# EAGLE design midiusb (EAGLE 5.11)
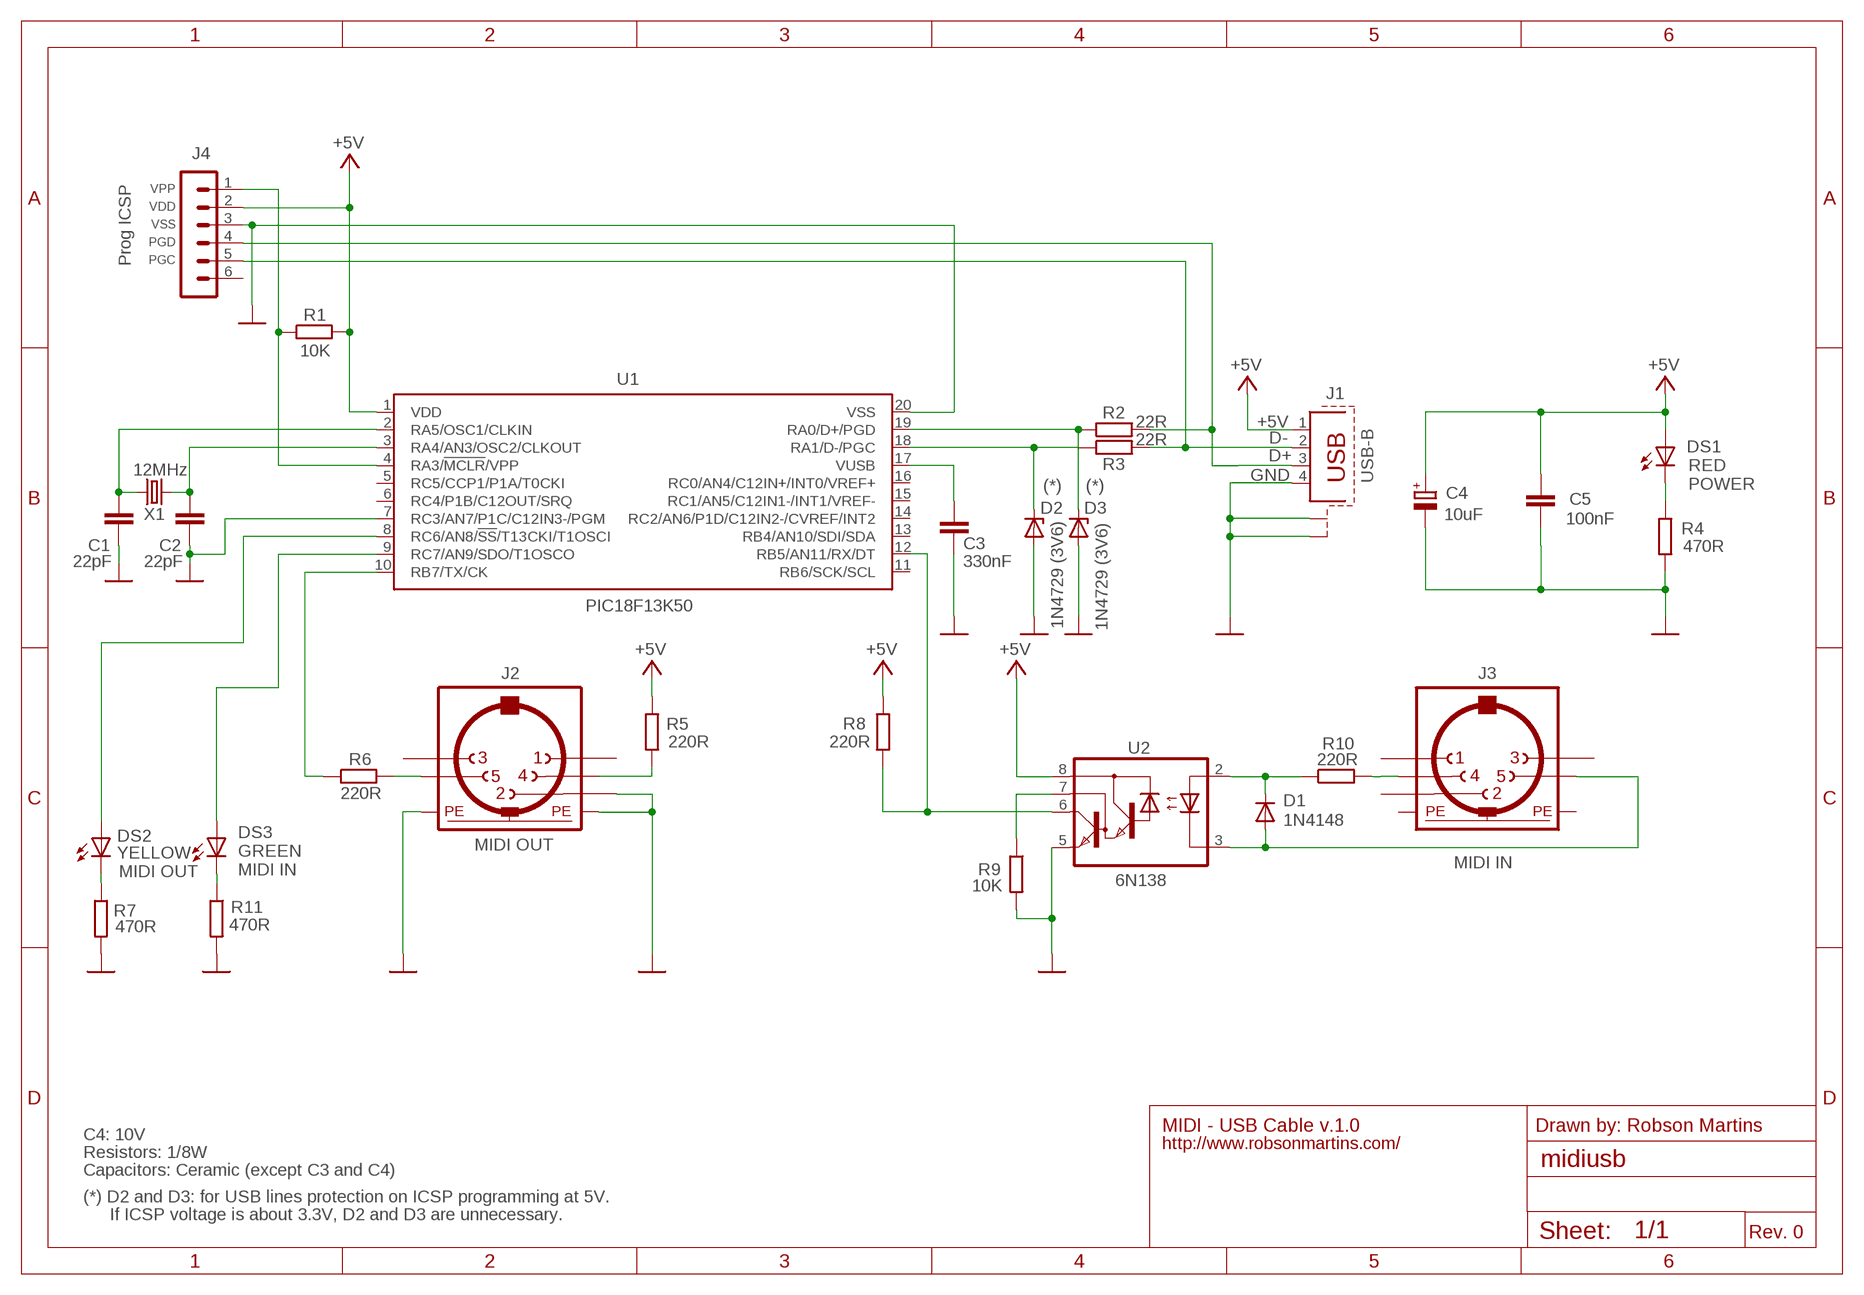
[diagram p0: schematic, sheet 1]

## Parts
C1  22pF  C-EU025-025X050  [C025-025X050]
C2  22pF  C-EU025-025X050  [C025-025X050]
C3  330nF  C-EU050-030X075  [C050-030X075]
C4  10uF  CPOL-EUE2,5-6E  [E2,5-6E]
C5  100nF  C-EU050-025X075  [C050-025X075]
D1  1N4148  1N4148DO35-7  [DO35-7]
D2  1N4729 (3V6)  ZENER-DIODEDO41Z10  [DO41Z10]
D3  1N4729 (3V6)  ZENER-DIODEDO41Z10  [DO41Z10]
DS1  RED  LED3MM  [LED3MM]
DS2  YELLOW  LED3MM  [LED3MM]
DS3  GREEN  LED3MM  [LED3MM]
J1  USB-B  PN61729-S  [PN61729-S]
J2  MAB5SH  [MAB5SH]
J3  MAB5SH  [MAB5SH]
J4  Prog ICSP  MA06-1  [MA06-1]
R1  10K  R-EU_0204/7  [0204/7]
R2  22R  R-EU_0204/7  [0204/7]
R3  22R  R-EU_0204/7  [0204/7]
R4  470R  R-EU_0204/7  [0204/7]
R5  220R  R-EU_0204/7  [0204/7]
R6  220R  R-EU_0204/7  [0204/7]
R7  470R  R-EU_0204/7  [0204/7]
R8  220R  R-EU_0204/7  [0204/7]
R9  10K  R-EU_0204/7  [0204/7]
R10  220R  R-EU_0204/7  [0204/7]
R11  470R  R-EU_0204/7  [0204/7]
U1  PIC18F13K50  PIC18F1XK50  [DIL20]
U2  6N138  [DIL08]
X1  12MHz  CRYSTALHC49U-V  [HC49U-V]

## Nets
+5V: C4.+ C5.1 DS1.A J1.1 J4.2 R1.2 R5.1 R8.1 U1.1(VDD) U2.8(VCC)
D+: J1.3 J4.4 R2.2
D-: J1.2 J4.5 R3.2
GND: C1.1 C2.1 C3.2 C4.- C5.2 D2.A D3.A J1.4 J1.S1 J1.S2 J2.2 J2.PE J2.PE@(PE) J4.3 R4.2 R7.2 R9.2 R11.2 U1.7(RC3/AN7/P1C/C12IN3-/PGM) U1.20(VSS) U2.5(GND)
LED_MIDI_IN: DS3.A U1.9(RC7/AN9/SDO/T1OSCO)
LED_MIDI_OUT: DS2.A U1.8(RC6/AN8/!SS!/T13CKI/T1OSCI)
N$13: D1.C R10.1 U2.2(A)
N$17: DS2.K(C) R7.1
N$20: R9.1 U2.7(VB)
N$21: DS3.K(C) R11.1
N$25: DS1.K(C) R4.1
OSC1: C1.2 U1.2(RA5/OSC1/CLKIN) X1.1
OSC2: C2.2 U1.3(RA4/AN3/OSC2/CLKOUT) X1.2
PGC_D-_CHIP: D2.C R3.1 U1.18(RA1/D-/PGC)
PGD_D+_CHIP: D3.C R2.1 U1.19(RA0/D+/PGD)
RX: R8.2 U1.12(RB5/AN11/RX/DT) U2.6(VO)
SINK_MIDI_IN: D1.A J3.5 U2.3(C)
SINK_MIDI_OUT: J2.5 R6.2
SRC_MIDI_IN: J3.4 R10.2
SRC_MIDI_OUT: J2.4 R5.2
TX: R6.1 U1.10(RB7/TX/CK)
VPP_ICSP: J4.1 R1.1 U1.4(RA3/!MCLR!/VPP)
VUSB: C3.1 U1.17(VUSB)
Unconnected: J2.1 J2.3 J3.1 J3.2 J3.3 J4.6 U1.5(RC5/CCP1/P1A/T0CKI) U1.6(RC4/P1B/C12OUT/SRQ) U1.11(RB6/SCK/SCL) U1.13(RB4/AN10/SDI/SDA) U1.14(RC2/AN6/P1D/C12IN2-/CVREF/INT2) U1.15(RC1/AN5/C12IN1-/INT1/VREF-) U1.16(RC0/AN4/C12IN+/INT0/VREF+)

## Notes on the sheet
- VPP
- VDD
- VSS
- PGD
- PGC
- (*) | (*) | POWER
- MIDI OUT
- MIDI IN
- MIDI OUT | MIDI IN
- MIDI - USB Cable v.1.0 | Drawn by: Robson Martins
- C4: 10V
- http://www.robsonmartins.com/
- Resistors: 1/8W
- Capacitors: Ceramic (except C3 and C4)
- (*) D2 and D3: for USB lines protection on ICSP programming at 5V.
- If ICSP voltage is about 3.3V, D2 and D3 are unnecessary.
- Rev. 0

## Power pins joined to a net without a drawn wire
PE: J3.PE J3.PE@(PE)

## Library data of the parts
C1-C3 C5 = rcl:C-EU: CAPACITOR, European symbol
C4 = rcl:CPOL-EU: POLARIZED CAPACITOR, European symbol
D1 = diode:1N4148: DIODE high speed (Philips)
D2 D3 = diode:ZENER-DIODE: Z-Diode
DS1-DS3 = led:LED: LED OSRAM: - CHIPLED LG R971, LG N971, LY N971, LG Q971, LY Q971, LO R971, LY R971 LH N974, LH R974 LS Q976, LO Q976, LY Q976 LO Q996 - Hyper CHIPLED LW Q18S LB Q993, LB Q99A, LB R99A - SideLED LS A670, LO A670, LY A670, LG A670, LP A670 LB A673, LV A673, LT A673, LW A673 LH A674 LY A675 LS A676, LA A676, LO A676, LY A676, LW A676 LS A679, LY A679, LG A679 - Hyper Micro SIDELED® LS Y876, LA Y876, LO Y876, LY Y876 LT Y87S - SmartLED LW L88C, LW L88S LB L89C, LB L89S, LG L890 LS L89K, LO L89K, LY L89K LS L896, LA L896, LO L896, LY L896 - TOPLED LS T670, LO T670, LY T670, LG T670, LP T670 LSG T670, LSP T670, LSY T670, LOP T670, LYG T670 LG T671, LOG T671, LSG T671 LB T673, LV T673, LT T673, LW T673 LH T674 LS T676, LA T676, LO T676, LY T676, LB T676, LH T676, LSB T676, LW T676 LB T67C, LV T67C, LT T67C, LS T67K, LO T67K, LY T67K, LW E67C LS E67B, LA E67B, LO E67B, LY E67B, LB E67C, LV E67C, LT E67C LW T67C LS T679, LY T679, LG T679 LS T770, LO T770, LY T770, LG T770, LP T770 LB T773, LV T773, LT T773, LW T773 LH T774 LS E675, LA E675, LY E675, LS T675 LS T776, LA T776, LO T776, LY T776, LB T776 LHGB T686 LT T68C, LB T68C - Hyper Mini TOPLED® LB M676 - Mini TOPLED Santana® LG M470 LS M47K, LO M47K, LY M47K Source: http://www.osram.convergy.de LUXEON: - LUMILED® LXK2-PW12-R00, LXK2-PW12-S00, LXK2-PW14-U00, LXK2-PW14-V00 LXK2-PM12-R00, LXK2-PM12-S00, LXK2-PM14-U00 LXK2-PE12-Q00, LXK2-PE12-R00, LXK2-PE12-S00, LXK2-PE14-T00, LXK2-PE14-U00 LXK2-PB12-K00, LXK2-PB12-L00, LXK2-PB12-M00, LXK2-PB14-N00, LXK2-PB14-P00, LXK2-PB14-Q00 LXK2-PR12-L00, LXK2-PR12-M00, LXK2-PR14-Q00, LXK2-PR14-R00 LXK2-PD12-Q00, LXK2-PD12-R00, LXK2-PD12-S00 LXK2-PH12-R00, LXK2-PH12-S00 LXK2-PL12-P00, LXK2-PL12-Q00, LXK2-PL12-R00 Source: www.luxeon.com KINGBRIGHT: KA-3528ASYC Source: www.kingbright.com
J1 = con-berg:PN61729-S: BERG USB connector; OC_FARNELL: unknown; OC_NEWARK: unknown
J2 J3 = con-hirschmann:MAB5SH: Female CONNECTOR 5 pins 90 deg. with shield, horizontal (DIN 41524); OC_FARNELL: 809883; OC_NEWARK: unknown
J4 = con-lstb:MA06-1: PIN HEADER; OC_FARNELL: unknown; OC_NEWARK: unknown
R1-R11 = resistor:R-EU_: RESISTOR, European symbol
U1 = microchip:PIC18F1XK50
U2 = optocoupler:6N138: MOTOROLA OPTO COUPLER; MF: VISHAY/TELEFUNKEN; MPN: 6N138; OC_FARNELL: 9860150; OC_NEWARK: 35K5294
X1 = crystal:CRYSTAL: CRYSTAL; OC_FARNELL: 1666969; OC_NEWARK: unknown

## Board
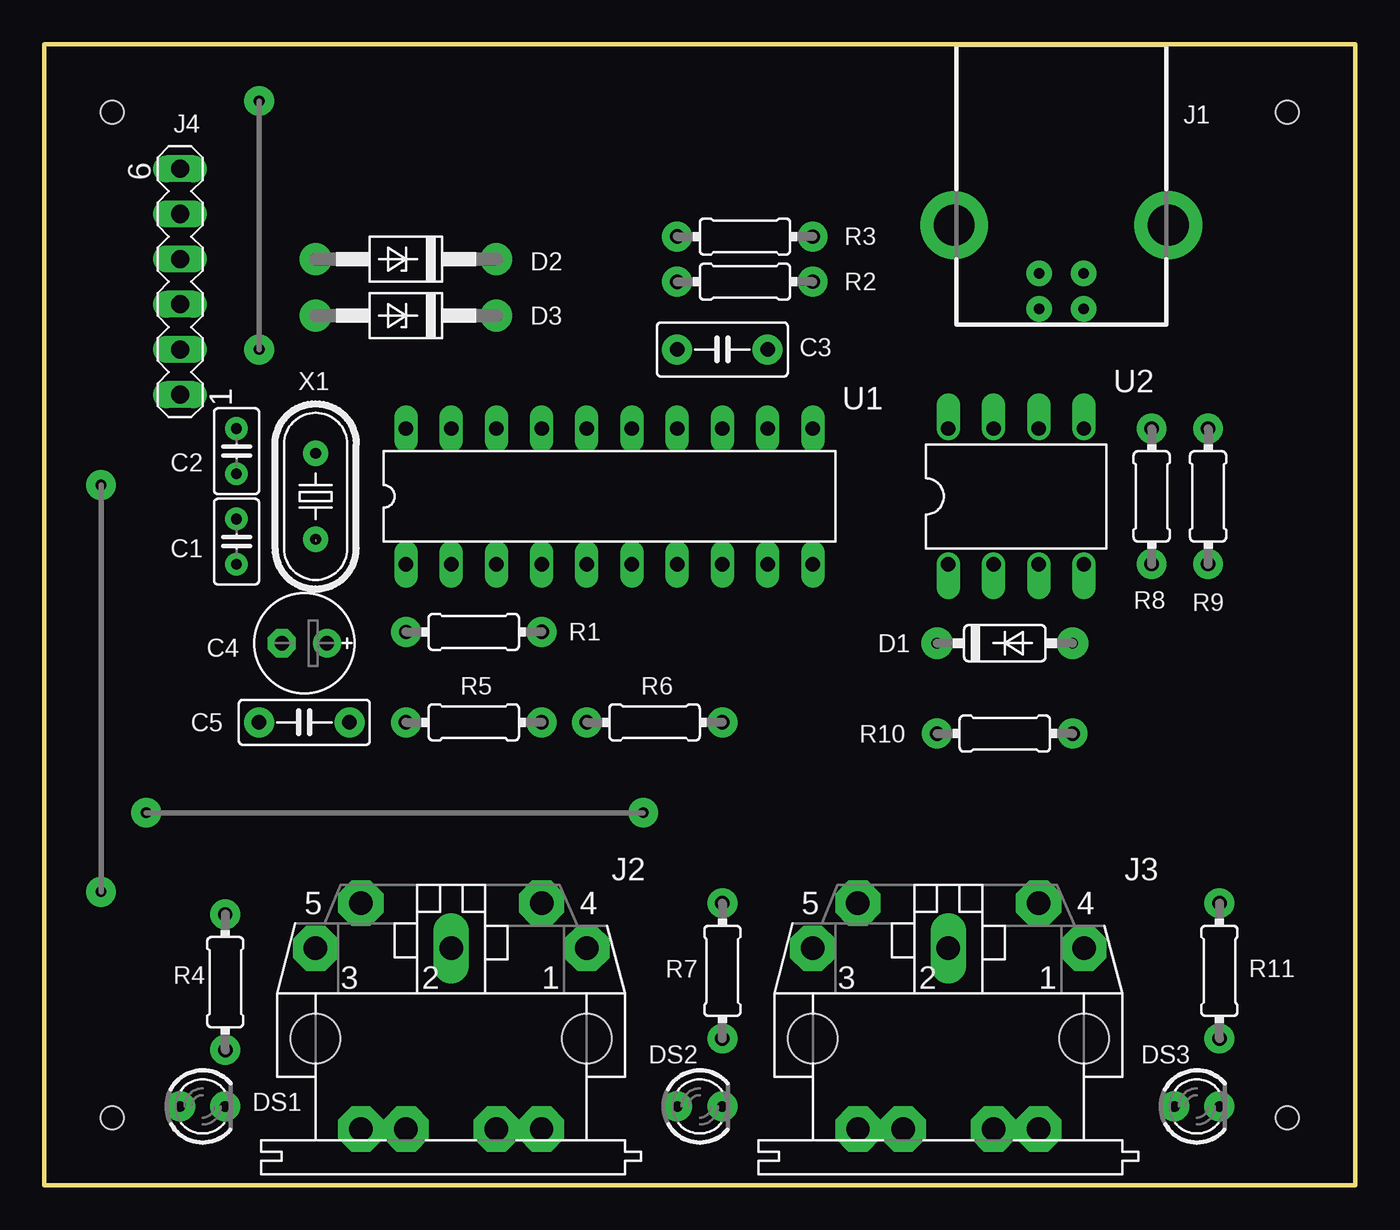
[diagram p1: board, top side]
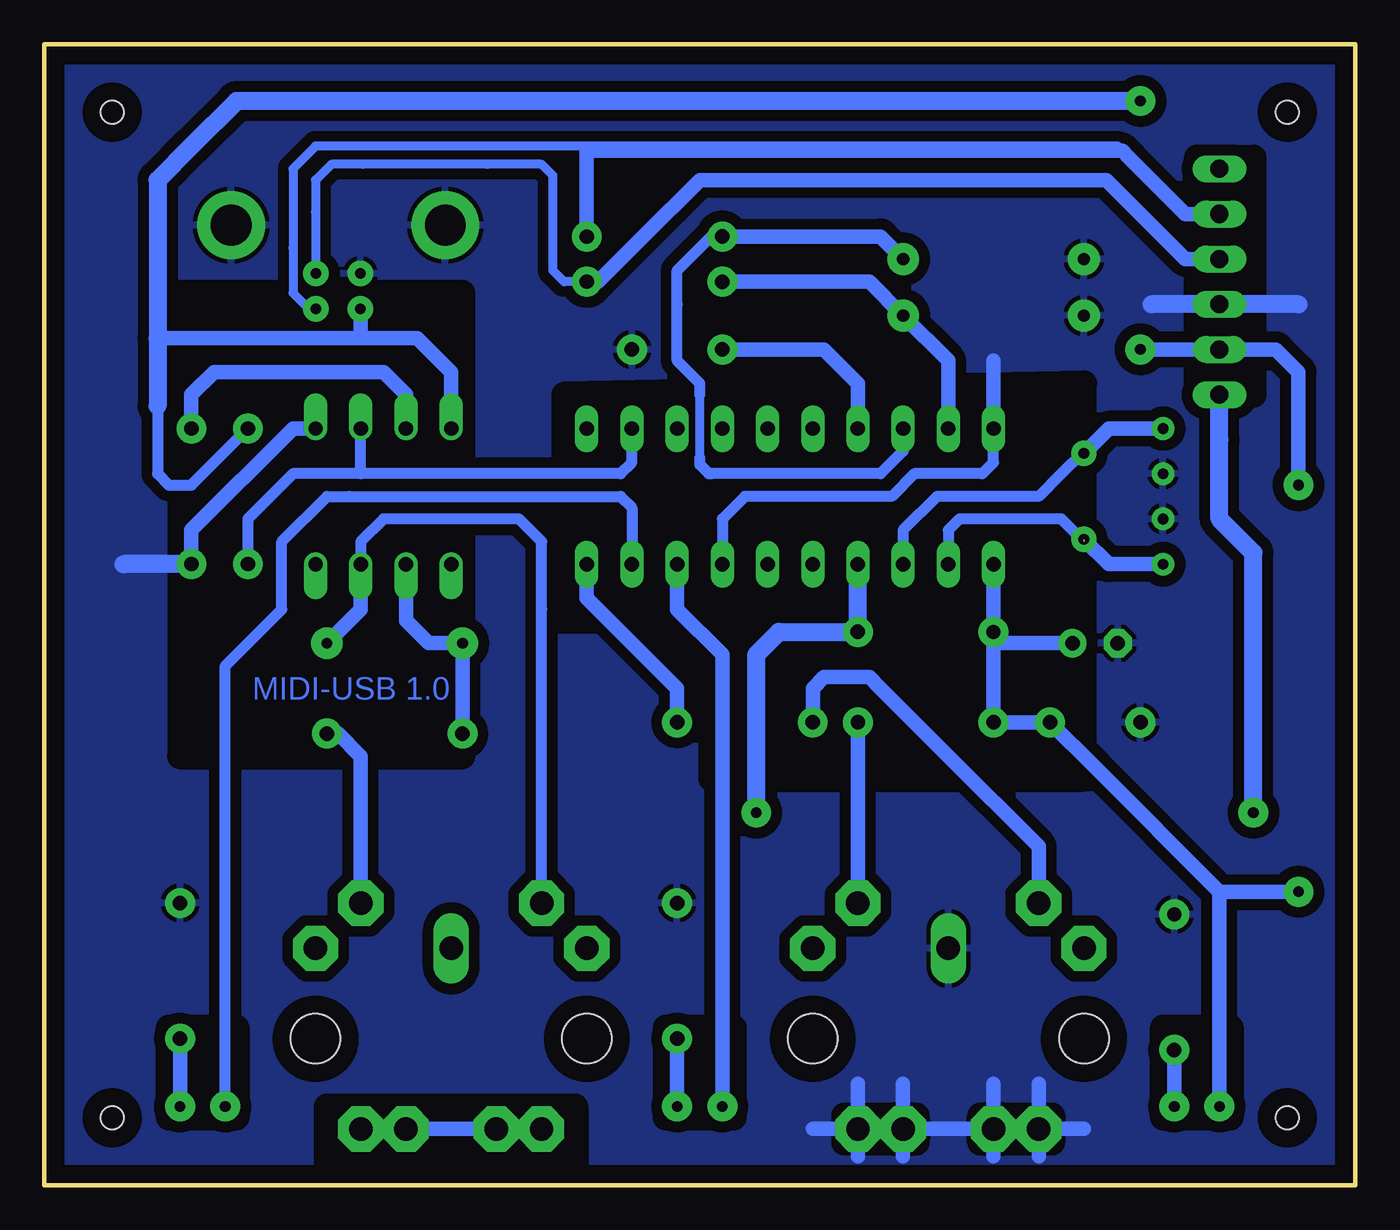
[diagram p2: board, bottom side, seen from below]

Size 73.66 x 64.14 mm. Coordinates in mm from the lower left corner, seen from the top.
Outline: 0,64.14 73.66,64.14 73.66,0 0,0 0,64.14
Copper layers (1*16): Top 0.035mm / dielectric 1.5mm / Bottom 0.035mm
Design rules "default": minimum track width 10mil, minimum drill 24mil, track to track 8mil, track to pad 8mil, pad to pad 8mil, via to via 8mil, smd to smd 8mil, copper to edge 40mil, drill to drill 8mil, minimum pad ring 10mil, minimum via ring 8mil, stop-mask expansion 4mil, vias tented up to drill 0mil, thermal gap 10mil
Holes 1.3 mm at 69.85,60.33 69.85,3.81 3.81,60.33 3.81,3.81
bRestrict: area 62.9,3.8 to 66.7,8.9; area 34.9,3.8 to 38.7,8.9; area 7,3.8 to 10.8,8.9; area 50.2,24.1 to 66,50.2; area 15.2,22.9 to 44.5,45.1; area 5.7,44.5 to 8.9,57.8; area 43.8,1.3 to 57.8,4.4; area 17,2.4 to 21.1,3.9; area 24.6,2.4 to 28.7,3.9

### Footprints (pad centres in the part's own frame; a part is rotated, then mirrored left to right if it is on the bottom)
C025-025X050 = drill 0.6 pad 1.27 round: 1 -1.27,0; 2 1.27,0
C050-030X075 = drill 0.813 pad 1.676 round: 1 -2.54,0; 2 2.54,0
E2,5-6E = drill 0.813 pad 1.575 round: + -1.27,0 | drill 0.813 pad 1.575 octagon: - 1.27,0
C050-025X075 = drill 0.813 pad 1.676 round: 1 -2.54,0; 2 2.54,0
DO35-7 = drill 0.6 pad 1.778 round: A 3.81,0; C -3.81,0
DO41Z10 = drill 0.7 pad 1.778 round: A 5.08,0; C -5.08,0
LED3MM = drill 0.6 pad 1.676 round: A -1.27,0; K 1.27,0
PN61729-S = drill 0.6 pad 1.422 round: 1 1.25,4.71; 2 -1.25,4.71; 3 -1.25,2.71; 4 1.25,2.71 | drill 2.3 pad 3.81 round: S1 -6.02,0; S2 6.02,0
MAB5SH = drill 1.321 pad 2.54 octagon: 1 7.62,5.08; 3 -7.62,5.08; 4 5.08,7.62; 5 -5.08,7.62; PE -2.54,-5.08; PE@ 2.54,-5.08 | drill 1.321 long: 2 0,5.08 | hole 2.794: 7.62,0; -7.62,0
MA06-1 = drill 1.016 long: 1 -6.35,0; 2 -3.81,0; 3 -1.27,0; 4 1.27,0; 5 3.81,0; 6 6.35,0
0204/7 = drill 0.813 pad 1.676 round: 1 -3.81,0 | drill 0.8 pad 1.676 round: 2 3.81,0
DIL20 = drill 0.813 long: 1 -11.43,-3.81; 2 -8.89,-3.81; 3 -6.35,-3.81; 4 -3.81,-3.81; 5 -1.27,-3.81; 6 1.27,-3.81; 7 3.81,-3.81; 8 6.35,-3.81; 9 8.89,-3.81; 10 11.43,-3.81; 11 11.43,3.81; 12 8.89,3.81; 13 6.35,3.81; 14 3.81,3.81; 15 1.27,3.81; 16 -1.27,3.81; 17 -3.81,3.81; 18 -6.35,3.81; 19 -8.89,3.81; 20 -11.43,3.81
DIL08 = drill 0.813 offset: 1 -3.81,-3.81; 2 -1.27,-3.81; 3 1.27,-3.81; 4 3.81,-3.81; 5 3.81,3.81; 6 1.27,3.81; 7 -1.27,3.81; 8 -3.81,3.81
HC49U-V = drill 0.6 pad 1.422 round: 1 -2.413,0; 2 2.413,0

### Placement (x,y rotation side)
C1  10.79,36.2 270 top
C2  10.79,41.27 90 top
C3  38.1,46.99 0 top
C4  14.61,30.48 180 top
C5  14.61,26.04 180 top
D1  53.98,30.48 0 top
D2  20.32,52.07 180 top
D3  20.32,48.9 180 top
DS1  8.89,4.45 0 top
DS2  36.83,4.45 0 top
DS3  64.77,4.45 0 top
J1  57.15,53.98 180 top
J2  22.86,8.26 0 top
J3  50.8,8.26 0 top
J4  7.62,50.8 90 top
R1  24.13,31.11 180 top
R2  39.37,50.8 0 top
R3  39.37,53.34 0 top
R4  10.16,11.43 90 top
R5  24.13,26.04 0 top
R6  34.29,26.04 180 top
R7  38.1,12.06 90 top
R8  62.23,38.73 270 top
R9  65.41,38.73 270 top
R10  53.98,25.4 0 top
R11  66.04,12.06 90 top
U1  31.75,38.73 0 top
U2  54.61,38.73 0 top
X1  15.24,38.73 90 top

### Tracks (layer width: path | path; a pad name or v marks a point on that pad's centre or on a via)
+5V  (via drill 0.6 pad 1.68)
  Top 0.254: v3.17,16.51 v3.17,39.37 | v12.06,46.99 v12.06,60.96
  Bottom 0.61: R8.1 65.41,39.37 66.67,39.37 67.31,40.01 67.31,43.81 67.31,47.62
  Bottom 0.813: 20.32,30.48 R5.1 C5.1 14.61,23.5 7.62,16.51 | 20.32,30.48 R1.2 U1.1 | 55.88,47.62 55.9,47.65 | U2.8 50.8,44.45 50.8,45.72 52.7,47.62 55.88,47.62 | 67.31,47.62 55.88,47.62 | 55.88,47.62 55.9,47.65 | 55.9,47.65 J1.1 | 55.88,47.62 55.9,47.65 | 20.32,30.48 C4.+ | DS1.A 7.62,16.51 | 7.62,16.51 v3.17,16.51 | v12.06,46.99 J4.2 4.45,46.99 3.17,45.72 v3.17,39.37
  Bottom 1.016: v12.06,60.96 62.87,60.96 65.41,58.42 67.31,56.52 67.31,47.62 67.31,43.81
D+
  Bottom 0.508: 58.42,51.28 58.42,54.74 58.42,56.52 57.53,57.4 55.75,57.4 48.77,57.4 45.72,57.4 45.09,56.77 45.09,51.44 44.45,50.8 R2.2
  Bottom 0.61: 58.42,51.28 J1.3
  Bottom 0.813: R2.2 42.55,50.8 40.01,53.34 36.83,56.52 13.97,56.52 9.53,52.07 J4.4
D-
  Bottom 0.406: 12.7,57.78 13.34,58.42
  Bottom 0.508: J1.2 58.79,49.27 59.69,50.16 59.69,52.7 59.69,57.15 58.42,58.42 48.26,58.42 13.34,58.42
  Bottom 0.813: R3.2 43.18,55.88 43.18,58.17 | 43.05,58.17 40.01,58.17 13.97,58.17 13.21,58.17 13.08,58.17 12.7,57.78 9.53,54.61 J4.5 | 43.05,58.17 43.18,58.17 | 43.05,58.17 43.18,58.17
GND  (via drill 1.3 pad 2.54)
  Bottom 0.406: 55.71,51.27 J1.4
  Bottom 0.61: U1.7 35.56,37.47 34.29,38.73 26.04,38.73 24.77,40.01 20.95,40.01 20.32,40.64 U1.20
  Bottom 0.813: U1.20 20.32,43.18 20.32,46.35 | U2.5 59.69,42.55 65.41,36.83 R9.2 | J2.PE@ v27.94,3.17 | J2.PE J2.PE@ | v17.78,3.17 J2.PE | v27.94,3.17 30.48,3.17 | v27.94,3.17 27.94,5.71 | J2.PE@ 25.4,5.71 | J2.PE 20.32,5.71 | v17.78,3.17 17.78,5.71 | v17.78,3.17 15.24,3.17 | 17.78,1.65 v17.78,3.17 | J2.PE 20.32,1.65 | J2.PE@ 25.4,1.65 | v27.94,3.17 27.94,1.65
  Bottom 1.016: R9.2 69.22,34.92 | 11.43,49.53 J4.3 3.17,49.53
  pour Bottom (isolate 0.61): 73.66,0 0,0 0,64.14 73.66,64.14
LED_MIDI_IN
  Bottom 0.61: U1.9 40.64,38.1 41.27,38.73 56.52,38.73 57.78,38.73 60.33,36.2 60.33,32.38 63.5,29.21 DS3.A
LED_MIDI_OUT
  Bottom 0.813: DS2.A 35.56,29.84 38.1,32.38 38.1,34.29 U1.8
N$13
  Bottom 0.813: R10.1 D1.C 52.07,30.48 53.34,31.75 U2.2
N$17
  Bottom 0.813: DS2.K 38.1,5.08 R7.1
N$20
  Bottom 0.813: U2.7 53.34,44.45 54.61,45.72 62.87,45.72 64.14,45.72 65.41,44.45 R9.1
N$21
  Bottom 0.813: DS3.K 66.04,5.08 R11.1
N$25
  Bottom 0.813: DS1.K 10.16,5.71 R4.1
OSC1  (1 unrouted)
  Bottom 0.61: U1.2 22.86,36.83 22.23,37.47 16.51,37.47 15.24,36.2
  Bottom 0.813: X1.1 13.84,34.92 C1.2
OSC2
  Bottom 0.61: U1.3 25.4,36.83 23.5,38.73 17.78,38.73 16.51,40.01 15.37,41.15 X1.2
  Bottom 0.813: X1.2 13.84,42.55 C2.2
PE  (via drill 1.3 pad 2.54)
  Bottom 0.813: v45.72,3.17 J3.PE J3.PE@ v55.88,3.17
PGC_D-_CHIP
  Bottom 0.508: 36.83,40.89 36.83,44.45
  Bottom 0.61: U1.18 25.4,41.27 26.67,40.01 36.2,40.01 36.32,40.01 36.83,40.51 36.83,40.89 | 36.83,44.45 36.83,45.09 38.1,46.35 38.1,49.53 38.1,51.44 36.2,53.34 R3.1
  Bottom 0.813: R3.1 26.67,53.34 D2.C
PGD_D+_CHIP
  Bottom 0.813: U1.19 22.86,43.18 | U1.19 22.86,44.45 | U1.19 22.86,45.72 22.86,46.35 D3.C 27.3,50.8 R2.1
RX
  Bottom 0.61: 55.88,40.01 U2.6 | U1.12 40.64,40.64 41.27,40.01 55.88,40.01 | 55.88,40.01 59.69,40.01 62.23,37.47 R8.2
SINK_MIDI_IN
  Bottom 0.61: J3.5 45.72,32.38 45.72,36.2 46.99,37.47 50.8,37.47 54.61,37.47 55.88,36.2 U2.3
  Bottom 0.813: U2.3 55.88,32.38 D1.A
SINK_MIDI_OUT
  Bottom 0.813: R6.2 30.48,27.94 29.84,28.57 27.3,28.57 26.67,27.94 22.86,24.13 17.78,19.05 J2.5
SRC_MIDI_IN
  Bottom 0.813: J3.4 55.88,24.13 57.15,25.4 R10.2
SRC_MIDI_OUT
  Bottom 0.813: J2.4 R5.2
TX
  Bottom 0.813: U1.10 43.18,33.02 38.1,27.94 R6.1
VPP_ICSP  (via drill 0.6 pad 1.68)
  Top 0.254: v5.71,20.95 v33.66,20.95
  Bottom 1.016: U1.4 R1.1 32.38,31.11 33.66,29.84 v33.66,20.95 | v5.71,20.95 5.71,35.56 7.62,37.47 7.62,41.91 J4.1
VUSB
  Bottom 0.813: U1.17 27.94,45.09 29.84,46.99 C3.1

### Text on the board
Bottom: MIDI-USB 1.0
tDocu: USB | MIDI-USB Adapter v.1.0 | PGC | ICSP | PGD | by Robson Martins (http://www.robsonmartins.com) | VSS | VDD | VPP | PIC18F13K50 | MIDI OUT | MIDI IN | PWR